# EAGLE schematic breakout (EAGLE 6.4)
AUTHOR: Pat Pannuto; REV: A; TITLE: Impulse-Breakout
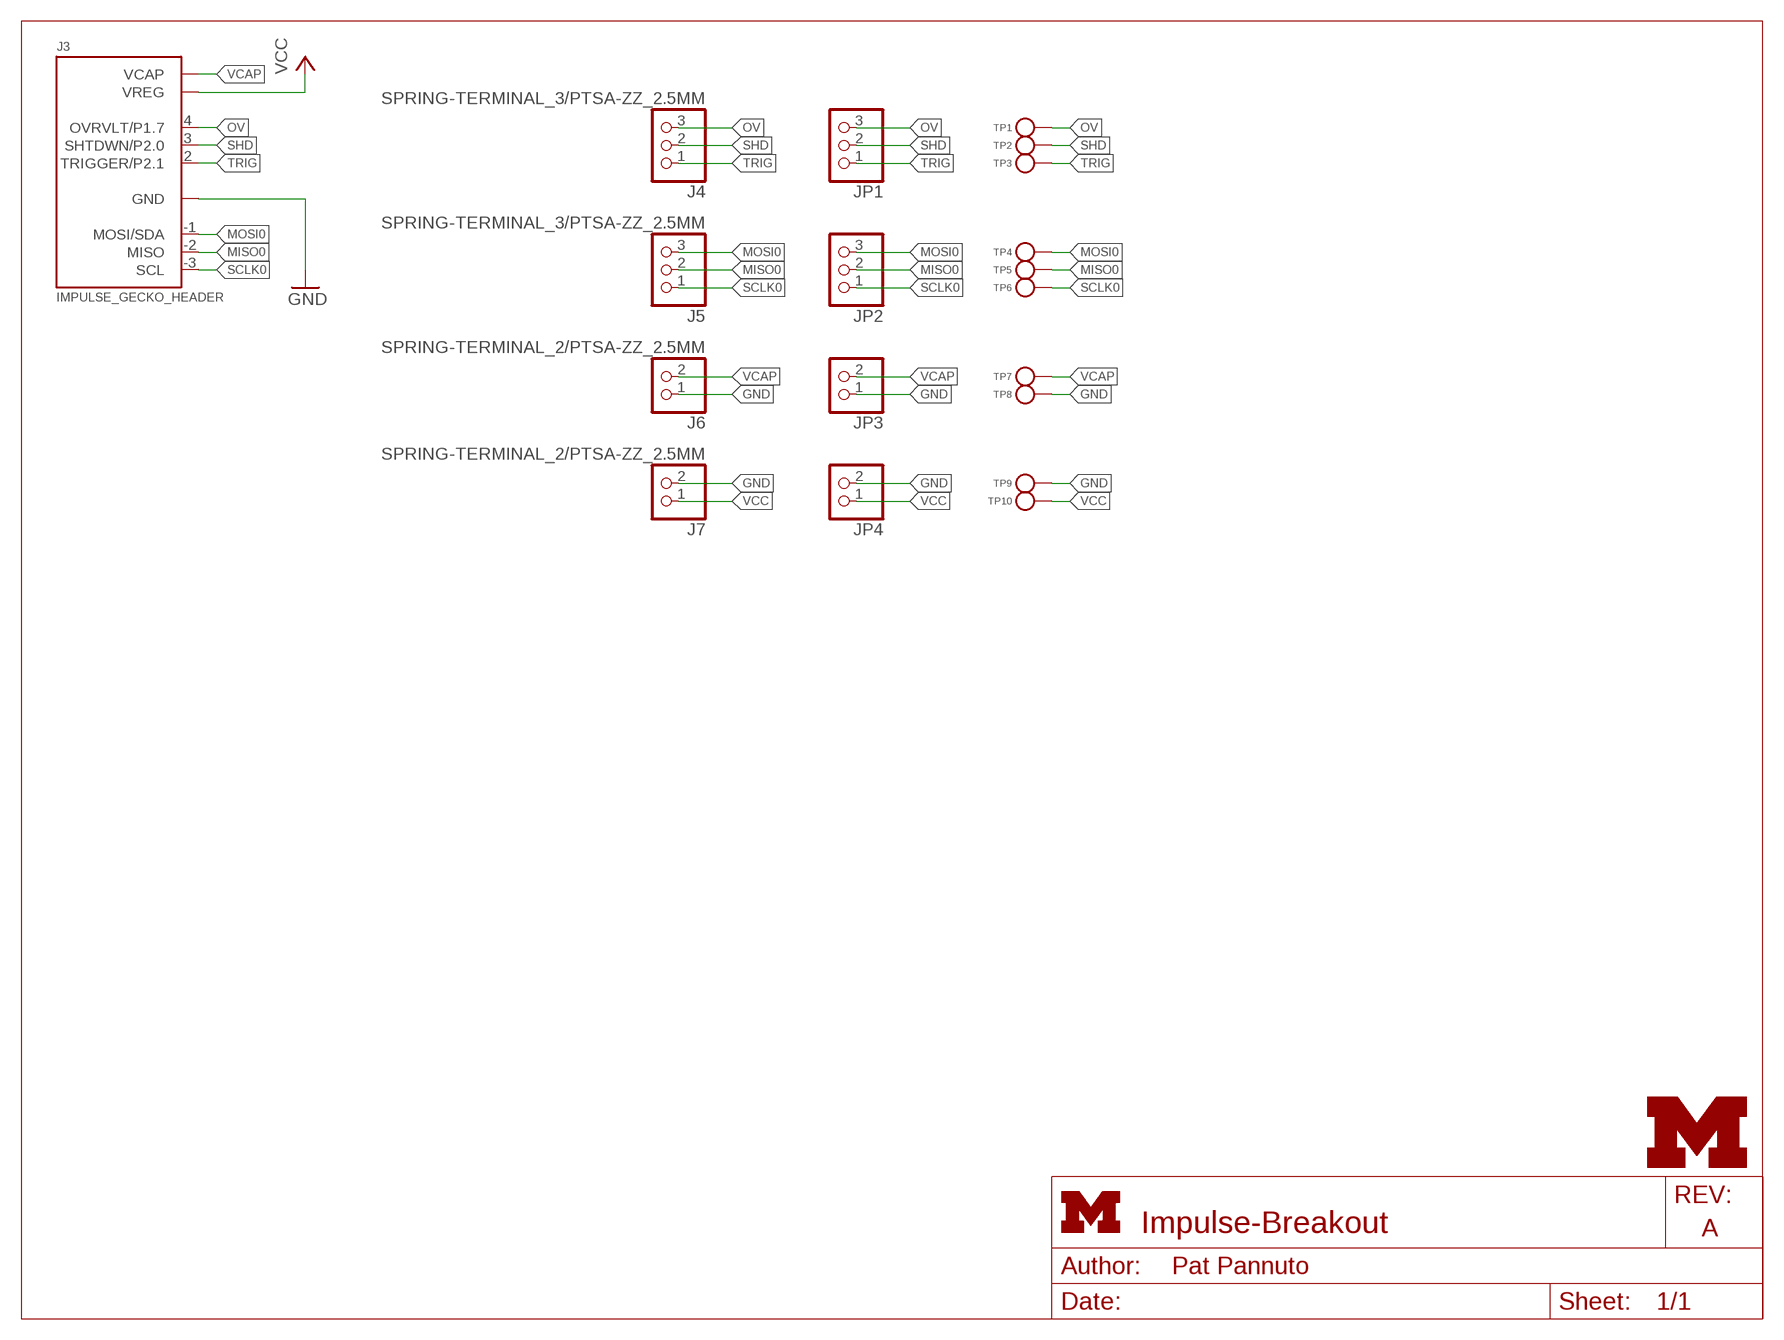
[diagram p0: schematic, sheet 1]
FRAME1 (LETTER_L): HEIGHT: 8.5in; WIDTH: 11in

## Parts
J3  IMPULSE_GECKO_HEADER  [HEADER1X9/0.05IN]
J4  SPRING-TERMINAL_3/PTSA-ZZ_2.5MM  [1X3/PTSA-ZZ_2.5MM]
J5  SPRING-TERMINAL_3/PTSA-ZZ_2.5MM  [1X3/PTSA-ZZ_2.5MM]
J6  SPRING-TERMINAL_2/PTSA-ZZ_2.5MM  [1X2/PTSA-ZZ_2.5MM]
J7  SPRING-TERMINAL_2/PTSA-ZZ_2.5MM  [1X2/PTSA-ZZ_2.5MM]
JP1  PINHD-1X3  [1X03]
JP2  PINHD-1X3  [1X03]
JP3  PINHD-1X2  [1X02]
JP4  PINHD-1X2  [1X02]
TP1  TEST_POINT_0.040IN  [TESTPOINT_0.040IN]
TP2  TEST_POINT_0.040IN  [TESTPOINT_0.040IN]
TP3  TEST_POINT_0.040IN  [TESTPOINT_0.040IN]
TP4  TEST_POINT_0.040IN  [TESTPOINT_0.040IN]
TP5  TEST_POINT_0.040IN  [TESTPOINT_0.040IN]
TP6  TEST_POINT_0.040IN  [TESTPOINT_0.040IN]
TP7  TEST_POINT_0.040IN  [TESTPOINT_0.040IN]
TP8  TEST_POINT_0.040IN  [TESTPOINT_0.040IN]
TP9  TEST_POINT_0.040IN  [TESTPOINT_0.040IN]
TP10  TEST_POINT_0.040IN  [TESTPOINT_0.040IN]
U$1  UMICH_SOLID_SMALL  [UMICH_SOLID_75MIL]

## Nets
GND: J3.0(GND) J6.1 J7.2 JP3.1 JP4.2 TP8.TESTPOINT TP9.TESTPOINT
MISO0: J3.-2(MISO) J5.2 JP2.2 TP5.TESTPOINT
MOSI0: J3.-1(MOSI/SDA) J5.3 JP2.3 TP4.TESTPOINT
OV: J3.4(OVRVLT/P1.7) J4.3 JP1.3 TP1.TESTPOINT
SCLK0: J3.-3(SCL) J5.1 JP2.1 TP6.TESTPOINT
SHD: J3.3(SHTDWN/P2.0) J4.2 JP1.2 TP2.TESTPOINT
TRIG: J3.2(TRIGGER/P2.1) J4.1 JP1.1 TP3.TESTPOINT
VCAP: J3.5(VCAP) J6.2 JP3.2 TP7.TESTPOINT
VCC: J3.1(VREG) J7.1 JP4.1 TP10.TESTPOINT

## Library data of the parts
J3 = gecko:IMPULSE_GECKO_HEADER: Header on the impulse EPIC-esque board.
J4 J5 = headers:SPRING-TERMINAL_3/PTSA-ZZ_2.5MM; DIGIKEY: 277-1795-ND
J6 J7 = headers:SPRING-TERMINAL_2/PTSA-ZZ_2.5MM; DIGIKEY: 277-1794-ND
JP1 JP2 = pinhead:PINHD-1X3: PIN HEADER
JP3 JP4 = pinhead:PINHD-1X2: PIN HEADER
TP1-TP10 = headers:TEST_POINT_0.040IN: 0.040in Test Point; DIGIKEY: 5001K-ND
U$1 = logos:UMICH_SOLID